# Altium schematic sheet USB_Connectors.SchDoc
size A3; PageSetup: Record=PageOptions|CenterHorizontal=True|CenterVertical=True|PrintScale=0.71|XCorrection=1.00|YCorrection=1.00|PrintKind=0|BorderSize=5000000|LeftOffset=0|BottomOffset=0|Orientation=2|PaperLength=1000|PaperWidth=1000|Scale=100|PaperSource=7|PrintQuality=-4|MediaType=1|DitherType=10|PaperKind=A4|PrintScaleMode=1; Date: 27.05.2014; DrawnBy: luths8; Organization: BFH; Address1: Bern University of Applied Sciences; Address2: Engineering and Information Technology; Address3: Jlcoweg 1; Address4: CH-3400 Burgdorf; DocumentNumber: 7; Revision: 1.0; SheetNumber: 10; SheetTotal: 19; CurrentDate: 27.05.2014
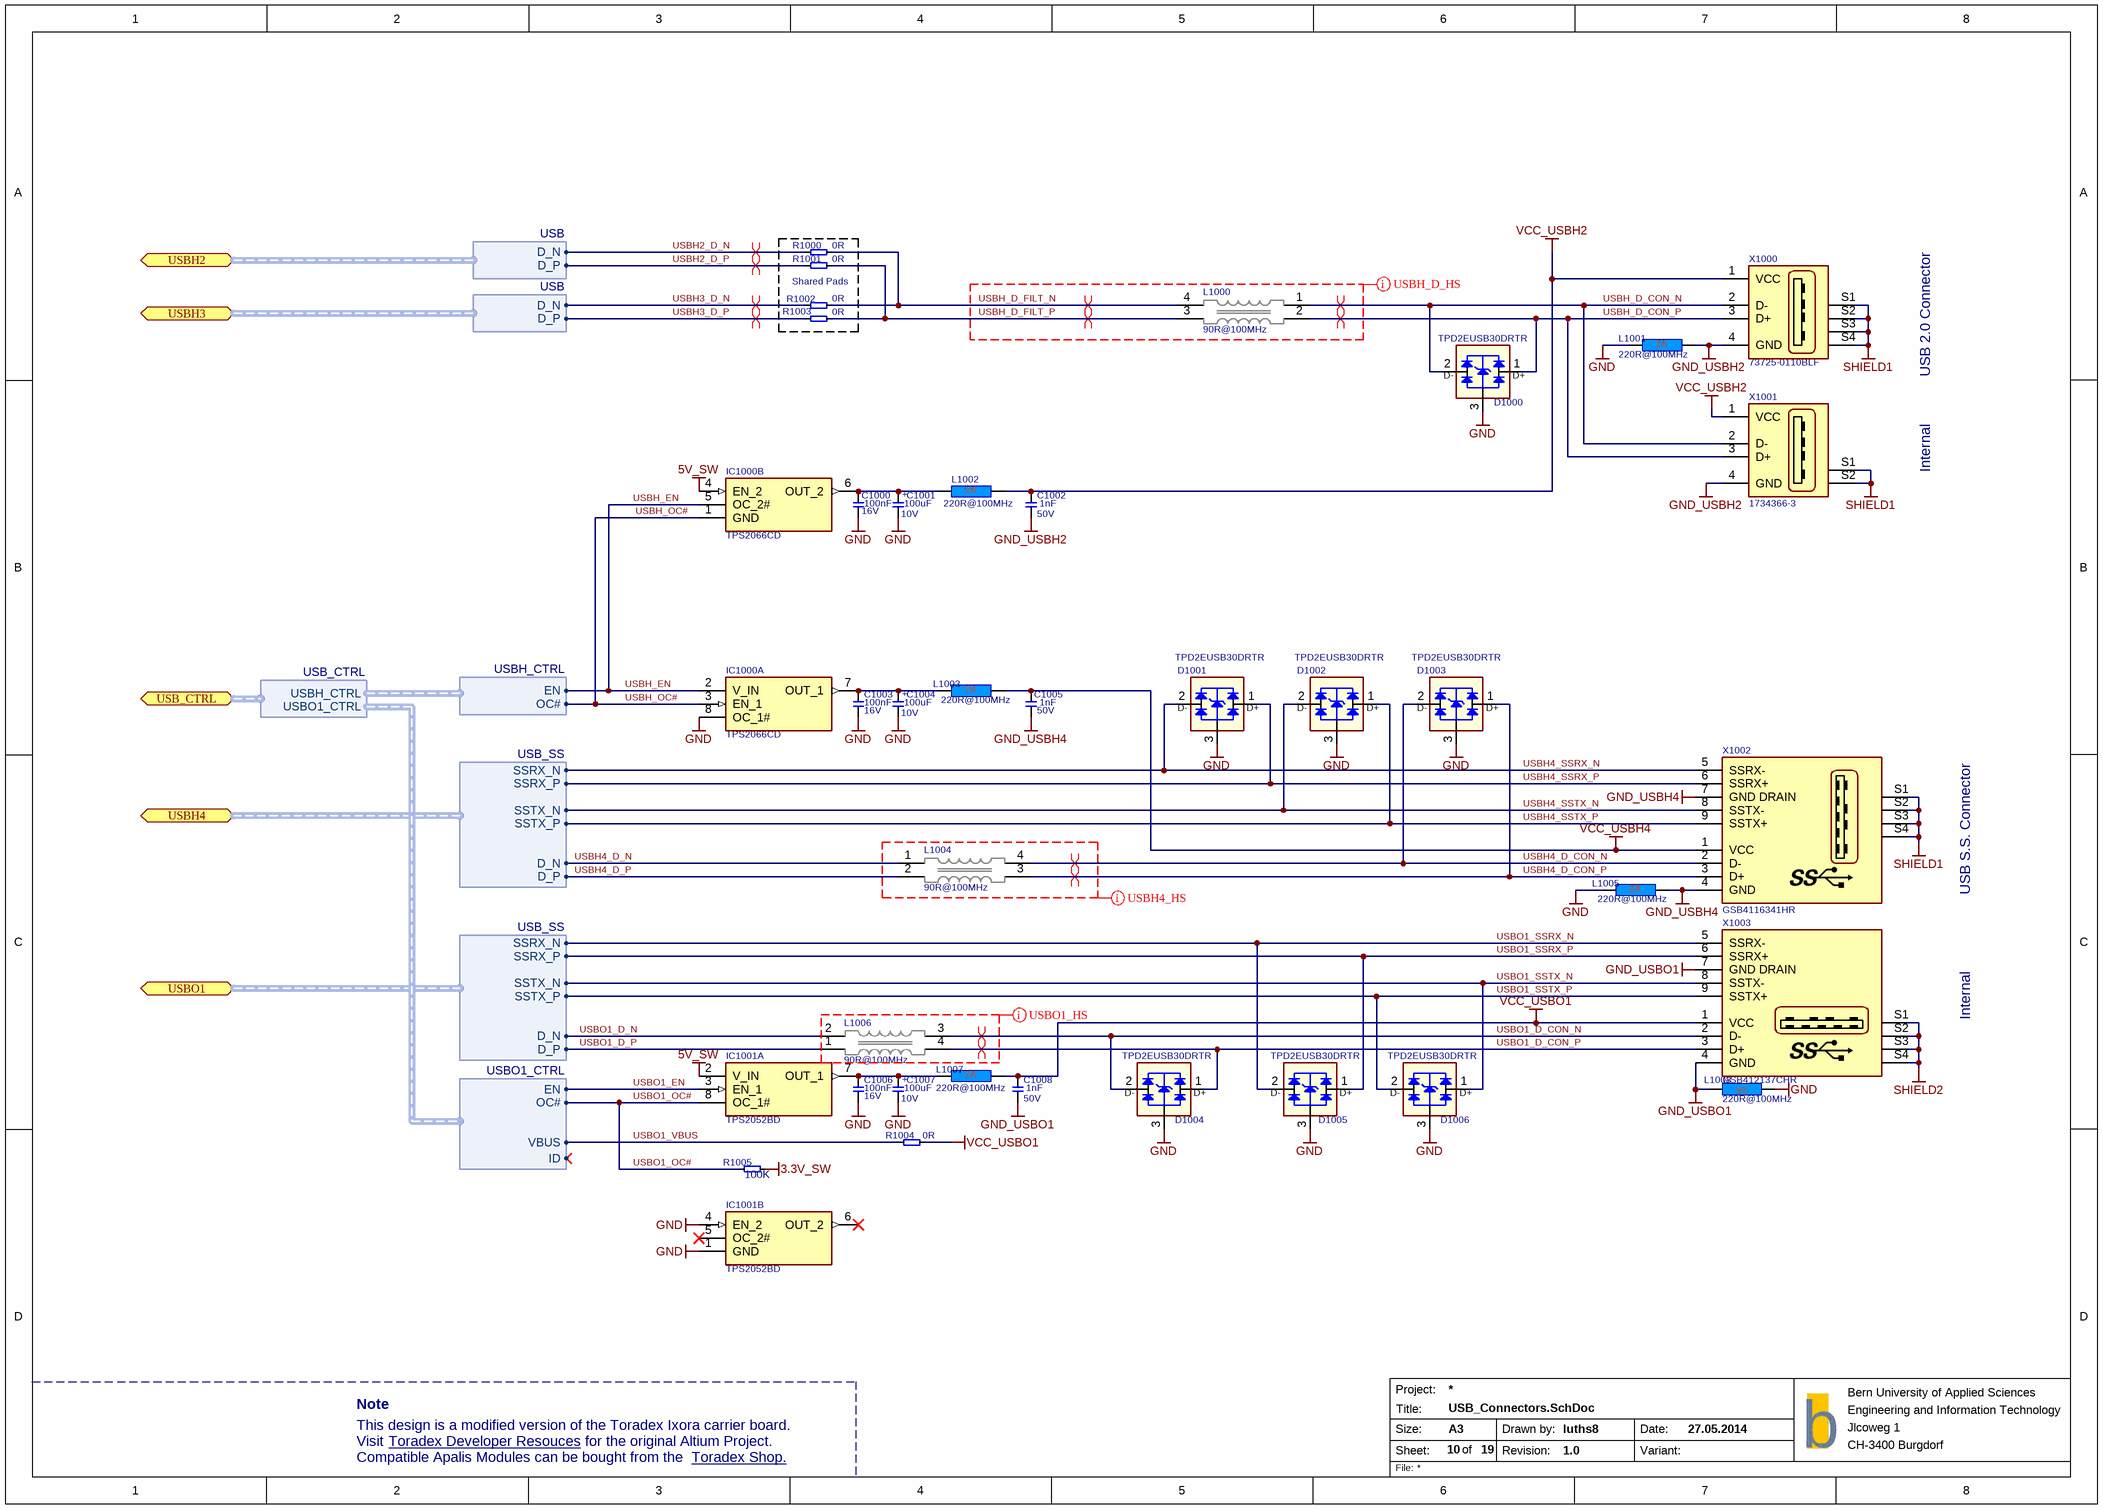
[diagram p0: USB_Connectors.SchDoc]

## Parts
C1000  Rating: 16V  [SMD0603CAP]  (hidden comment: 100nF)
C1001  Rating: 10V  [CAPMP6032X280N]  (hidden comment: 100uF)
C1002  Rating: 50V  [SMD0603CAP]  (hidden comment: 1nF)
C1003  Rating: 16V  [SMD0603CAP]  (hidden comment: 100nF)
C1004  Rating: 10V  [CAPMP6032X280N]  (hidden comment: 100uF)
C1005  Rating: 50V  [SMD0603CAP]  (hidden comment: 1nF)
C1006  Rating: 16V  [SMD0603CAP]  (hidden comment: 100nF)
C1007  Rating: 10V  [CAPMP6032X280N]  (hidden comment: 100uF)
C1008  Rating: 50V  [SMD0603CAP]  (hidden comment: 1nF)
D1000  TPD2EUSB30DRTR  [T_TI_TPD2EUSB30DRTR]
D1001  TPD2EUSB30DRTR  [T_TI_TPD2EUSB30DRTR]
D1002  TPD2EUSB30DRTR  [T_TI_TPD2EUSB30DRTR]
D1003  TPD2EUSB30DRTR  [T_TI_TPD2EUSB30DRTR]
D1004  TPD2EUSB30DRTR  [T_TI_TPD2EUSB30DRTR]
D1005  TPD2EUSB30DRTR  [T_TI_TPD2EUSB30DRTR]
D1006  TPD2EUSB30DRTR  [T_TI_TPD2EUSB30DRTR]
IC1000  TPS2066CD  [SOIC127P600X173-8N]  (parts A,B of 2)
IC1001  TPS2052BD  [SOIC127P600X173-8N]  (parts A,B of 2)
L1000  90R@100MHz  [T_Murata_DLW21SN900SQ2]
L1001  220R@100MHz  [INDC1608X95N]
L1002  220R@100MHz  [INDC1608X95N]
L1003  220R@100MHz  [INDC1608X95N]
L1004  90R@100MHz  [T_Murata_DLW21SN900SQ2]
L1005  220R@100MHz  [INDC1608X95N]
L1006  90R@100MHz  [T_Murata_DLW21SN900SQ2]
L1007  220R@100MHz  [INDC1608X95N]
L1008  220R@100MHz  [INDC1608X95N]
R1000  0R  [SMD0603RES]
R1001  0R  [SMD0603RES]
R1002  0R  [SMD0603RES]
R1003  0R  [SMD0603RES]
R1004  0R  [SMD0603RES]
R1005  100K  [SMD0603RES]
X1000  Manufacturer Part No.: 73725-0110BLF  [T_FCI_73725-0110BLF]  (hidden comment: CON-Fci-73725-0110BLF)
X1001  CON-TE-1734366-3  [1734366-3]  (value not drawn)
X1002  GSB4116341HR  [GSB4116341HR]
X1003  GSB412137CHR  [GSB412137CHR]

## Blocks framed on the sheet
Shared Pads: R1000-R1003

## Ports
USB_CTRL (bidir, harness USB_CTRL), USBH2 (bidir, harness USB), USBH3 (bidir, harness USB), USBH4 (bidir, harness USB_SS), USBO1 (bidir, harness USB_SS)

## Harnesses
USB_SS: D_N, D_P, SSTX_N, SSTX_P, SSRX_N, SSRX_P
USBO1_CTRL: VBUS, ID, OC#, EN
USBH_CTRL: OC#, EN
USB_CTRL: USBO1_CTRL, USBH_CTRL
USB: D_N, D_P

## Nets
3.3V_SW: R1005.2
5V_SW: IC1000.4(EN_2) IC1001.2(V_IN)
GND: C1000.1 C1001.2 C1003.1 C1004.2 C1006.1 C1007.2 D1000.3 D1001.3 D1002.3 D1003.3 D1004.3 D1005.3 D1006.3 IC1000.8(OC_1#) IC1001.1(GND) IC1001.4(EN_2) L1001.1 L1005.1 L1008.1
GND_USBH2: C1002.1 L1001.2 X1000.4(GND) X1001.4(GND)
GND_USBH4: C1005.1 L1005.2 X1002.4(GND) X1002.7(GND_DRAIN)
GND_USBO1: C1008.1 L1008.2 X1003.4(GND) X1003.7(GND_DRAIN)
SHIELD1: X1000.S1 X1000.S2 X1000.S3 X1000.S4 X1001.S1 X1001.S2 X1002.S1 X1002.S2 X1002.S3 X1002.S4
SHIELD2: X1003.S1 X1003.S2 X1003.S3 X1003.S4
VCC_USBH2: C1002.2 L1002.2 X1000.1(VCC) X1001.1(VCC)
VCC_USBH4: C1005.2 L1003.2 X1002.1(VCC)
VCC_USBO1: C1008.2 L1007.2 R1004.2 X1003.1(VCC)
USBH2_D_N: R1000.1 ; port USBH2.D_N
USBH2_D_P: R1001.1 ; port USBH2.D_P
USBH3_D_N: R1002.1 ; port USBH3.D_N
USBH3_D_P: R1003.1 ; port USBH3.D_P
USBH4_D_CON_N: D1003.2(D-) L1004.4 X1002.2(D-)
USBH4_D_CON_P: D1003.1(D+) L1004.3 X1002.3(D+)
USBH4_D_N: L1004.1 ; port USBH4.D_N
USBH4_D_P: L1004.2 ; port USBH4.D_P
USBH4_SSRX_N: D1001.2(D-) X1002.5(SSRX-) ; port USBH4.SSRX_N
USBH4_SSRX_P: D1001.1(D+) X1002.6(SSRX+) ; port USBH4.SSRX_P
USBH4_SSTX_N: D1002.2(D-) X1002.8(SSTX-) ; port USBH4.SSTX_N
USBH4_SSTX_P: D1002.1(D+) X1002.9(SSTX+) ; port USBH4.SSTX_P
USBH_D_CON_N: D1000.2(D-) L1000.1 X1000.2(D-) X1001.2(D-)
USBH_D_CON_P: D1000.1(D+) L1000.2 X1000.3(D+) X1001.3(D+)
USBH_D_FILT_N: L1000.4 R1000.2 R1002.2
USBH_D_FILT_P: L1000.3 R1001.2 R1003.2
USBH_EN: IC1000.2(V_IN) IC1000.5(OC_2#) ; harness USBH_CTRL.EN
USBH_OC#: IC1000.1(GND) IC1000.3(EN_1) ; harness USBH_CTRL.OC#
USBO1_D_CON_N: D1004.2(D-) L1006.3 X1003.2(D-)
USBO1_D_CON_P: D1004.1(D+) L1006.4 X1003.3(D+)
USBO1_D_N: L1006.2 ; port USBO1.D_N
USBO1_D_P: L1006.1 ; port USBO1.D_P
USBO1_EN: IC1001.3(EN_1) ; harness USBO1_CTRL.EN
USBO1_OC#: IC1001.8(OC_1#) R1005.1 ; harness USBO1_CTRL.OC#
USBO1_SSRX_N: D1005.2(D-) X1003.5(SSRX-) ; port USBO1.SSRX_N
USBO1_SSRX_P: D1005.1(D+) X1003.6(SSRX+) ; port USBO1.SSRX_P
USBO1_SSTX_N: D1006.1(D+) X1003.8(SSTX-) ; port USBO1.SSTX_N
USBO1_SSTX_P: D1006.2(D-) X1003.9(SSTX+) ; port USBO1.SSTX_P
USBO1_VBUS: R1004.1 ; harness USBO1_CTRL.VBUS
NetC1000_2: C1000.2 C1001.1 IC1000.6(OUT_2) L1002.1
NetC1003_2: C1003.2 C1004.1 IC1000.7(OUT_1) L1003.1
NetC1006_2: C1006.2 C1007.1 IC1001.7(OUT_1) L1007.1

Not connected (* = marked no-connect by the designer): IC1001 5(OC_2#)* 6(OUT_2)*

## Layout directives
differential pair: USBH2_D_N, USBH2_D_P, USBH3_D_N, USBH3_D_P, USBH4_D_CON_N, USBH4_D_CON_P, USBH_D_CON_N, USBH_D_CON_P, USBH_D_FILT_N, USBH_D_FILT_P, USBO1_D_CON_N, USBO1_D_CON_P
net class USBO1_HS: (no net found under the mark)
net class USBH4_HS: (no net found under the mark)
net class USBH_D_HS: USBH_D_FILT_N, USBH_D_FILT_P

## Notes on the sheet
- USB 2.0 Connector
- Internal
- USB S.S. Connector
- Note
- This design is a modified version of the Toradex Ixora carrier board.
- Visit
- Compatible Apalis Modules can be bought from the
- Toradex Developer Resouces <https://developer.toradex.com/products/ixora-carrier-board>
- for the original Altium Project.
- Toradex Shop. <https://www.toradex.com/order-now/apalis-arm-family>
- Project:
- Size:
- Sheet:
- Title:
- A3
- of
- Drawn by:
- Revision:
- Date:
- Variant:
- b
- File:
- (in symbol C-TA-100uF-10V-10%-6032) +

## Library data of the parts
C1000 C1003 C1006 = C-X7R-100nF-16V-10%-0402: Capacitor Ceramic X7R 100nF 16V 10% 0603; Tolerance: 10%; Type: X7R; Value: 100nF
C1001 C1004 C1007 = C-TA-100uF-10V-10%-6032: Capacitor TA 100uF 10V 10% 6032; Tolerance: 10%; Type: TA; Value: 100uF
C1002 C1005 C1008 = C-X7R-1nF-50V-10%-0402: Capacitor Ceramic X7R 1nF 50V 10% 0603; Tolerance: 10%; Type: X7R; Value: 1nF
D1000-D1006 = D-TI-TPD2EUSB30DRTR: 2 Channel Protection for Super Speed USB3.0; Manufacturer Name: TI; Manufacturer Part No.: TPD2EUSB30DRTR
IC1000 = IC-TI-TPS2066CD: 1A Dual High Side Switch (Current Limiting (Fixed), Over Temperature, Reverse Current, UVLO); Manufacturer Name: Texas Instruments; Manufacturer Part No.: TPS2066CD
IC1001 = IC-TI-TPS2052BD: Dual High Side Switch With OC_DET 500mA/CH; Manufacturer Name: Texas Instruments; Manufacturer Part No.: TPS2052BD
L1000 L1004 L1006 = L-Murata-DLW21SN900SQ2-90R@100MHz-330mA-25%: Common Mode Choke High Speed 90R 330mA; Manufacturer Name: Murata; Tolerance: 25%; Rating: 330mA; Manufacturer Part No.: DLW21SN900SQ2; Value: 90R@100MHz
L1001-L1003 L1005 L1007 L1008 = L-220R@100MHz-2A-25%-0603: 220R@100MHz 2A EMI FILTER; Tolerance: 25%; Rating: 2A; Value: 220R@100MHz
R1000-R1003 = R-0R-63mW-1%-0603: Resistor 0 ohm 63mW 1% 0603; Rating: 63mW; Tolerance: 1%; Value: 0R
R1004 = R-0R-63mW-1%-0402: Resistor 0 ohm 63mW 1% 0603; Rating: 63mW; Tolerance: 1%; Value: 0R
R1005 = R-100KR-63mW-5%-0402: Resistor 100 Kohm 63mW 5% 0603; Value: 100KR; Rating: 63mW; Tolerance: 5%
X1000 = CON-Fci-73725-0110BLF: USB Type A Connector; Manufacturer Name: FCI; No. of ways: 4; System: Connector
X1001 = CON-TE-1734366-3: USB Type A Connector Vertical; Manufacturer Name: TE; Manufacturer Part No.: 1734366-3; System: Connector
X1002 = CON-Amphenol-GSB4116341HR: USB 3.1, Type A, sideways; System: Connector; Manufacturer Name: Amphenol; Manufacturer Part No.: GSB4116341HR
X1003 = CON-Amphenol-GSB412137CHR: USB 3.1, Type A, vertical; System: Connector; Manufacturer Name: Amphenol; Manufacturer Part No.: GSB412137CHR